# EAGLE design TERRA-v1 (EAGLE 9.6.2)
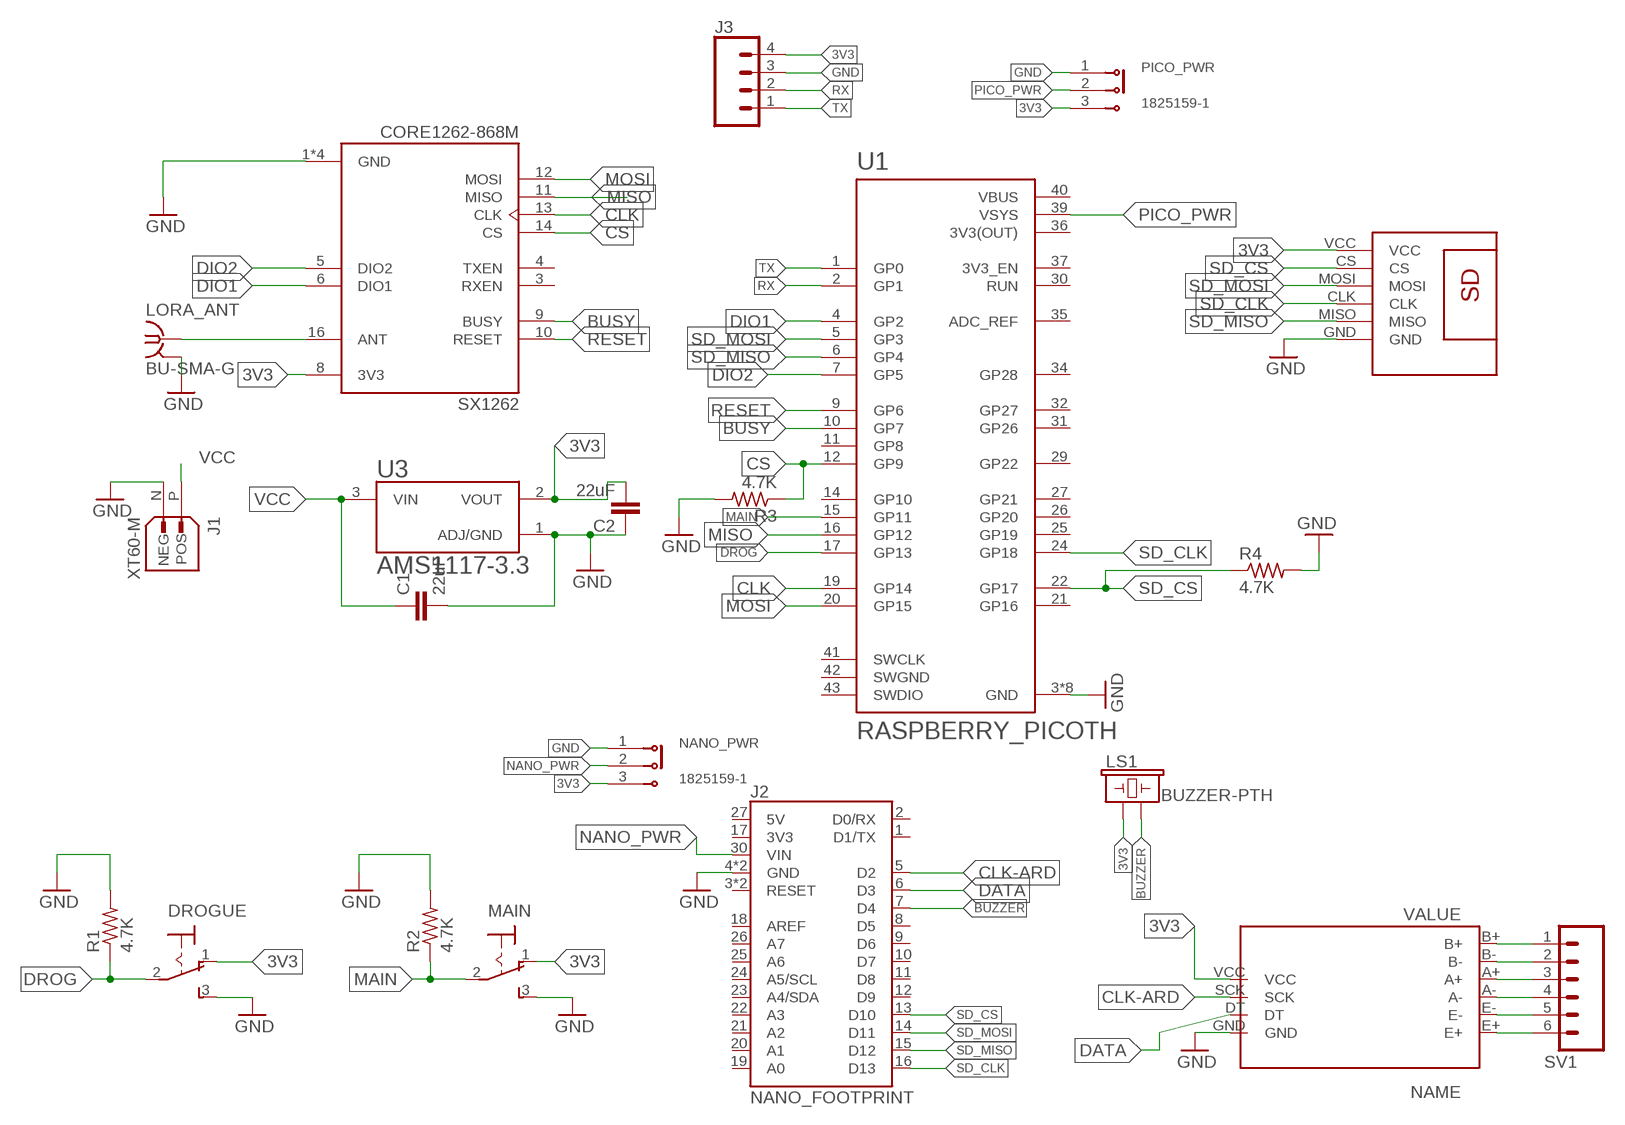
[diagram p0: schematic, sheet 1]

## Parts
C1  22uF  22UF-0805-6.3V-20%  [0805]
C2  22uF  22UF-0805-6.3V-20%  [0805]
DROGUE  M9040P  [M9040P]
HX711  HX711  HX711A  [HX711]
J1  XT60-M  [AMASS_XT60-M]
J2  NANO_FOOTPRINT  [NANO]
J3  CONN_04PTH  [1X04]
LORA_ANT  BU-SMA-G  [BU-SMA-G]
LS1  BUZZER-PTH  [BUZZER-12MM]
MAIN  M9040P  [M9040P]
NANO_PWR  1825159-1  [SW_1825159-1]
PICO_PWR  1825159-1  [SW_1825159-1]
R1  4.7K  R-US_R0805  [R0805]
R2  4.7K  R-US_R0805  [R0805]
R3  4.7K  R-US_R0805  [R0805]
R4  4.7K  R-US_R0805  [R0805]
SV1  CONN_06SILK_FEMALE_PTH  [1X06]
SX1262  CORE1262-868M  [XCVR_CORE1262-868M]
U1  RASPBERRY_PICOTH  [PICO-PKG-TH]
U3  AMS1117-3.3  [SOT229P700X180-4N]
U$1  SDREADER  [SDREADER]

## Nets
3V3: C2.2 DROGUE.1(O) HX711.VCC J3.4 LS1.+ MAIN.1(O) NANO_PWR.3 PICO_PWR.3 SX1262.8(3V3) U3.2(VOUT) U$1.VCC
BUSY: SX1262.9(BUSY) U1.10(GP7)
BUZZER: J2.7(D4) LS1.-
CLK: SX1262.13(CLK) U1.19(GP14)
CLK-ARD: HX711.SCK J2.5(D2)
CS: R3.1 SX1262.14(CS) U1.12(GP9)
DATA: HX711.DT J2.6(D3)
DIO1: SX1262.6(DIO1) U1.4(GP2)
DIO2: SX1262.5(DIO2) U1.7(GP5)
DROG: DROGUE.2(P) R1.1 U1.17(GP13)
GND: C1.2 C2.1 DROGUE.3(S) HX711.GND J1.N(NEG) J2.4(GND) J2.29(GND) J3.3 LORA_ANT.2 LORA_ANT.3 LORA_ANT.4 LORA_ANT.5 MAIN.3(S) NANO_PWR.1 PICO_PWR.1 R1.2 R2.2 R3.2 R4.2 SX1262.1(GND) SX1262.2(GND) SX1262.7(GND) SX1262.15(GND) U1.3(GND) U1.8(GND) U1.13(GND) U1.18(GND) U1.23(GND) U1.28(GND) U1.33(GND) U1.38(GND) U3.1(ADJ/GND) U$1.GND
MAIN: MAIN.2(P) R2.1 U1.15(GP11)
MISO: SX1262.11(MISO) U1.16(GP12)
MOSI: SX1262.12(MOSI) U1.20(GP15)
N$1: LORA_ANT.1 SX1262.16(ANT)
N$2: HX711.B+ SV1.1
N$3: HX711.B- SV1.2
N$4: HX711.A+ SV1.3
N$5: HX711.A- SV1.4
N$6: HX711.E- SV1.5
N$7: HX711.E+ SV1.6
NANO_PWR: J2.30(VIN) NANO_PWR.2
PICO_PWR: PICO_PWR.2 U1.39(VSYS)
RESET: SX1262.10(RESET) U1.9(GP6)
RX: J3.2 U1.2(GP1)
SD_CLK: J2.16(D13) U1.24(GP18) U$1.CLK
SD_CS: J2.13(D10) R4.1 U1.22(GP17) U$1.CS
SD_MISO: J2.15(D12) U1.6(GP4) U$1.MISO
SD_MOSI: J2.14(D11) U1.5(GP3) U$1.MOSI
TX: J3.1 U1.1(GP0)
VCC: C1.1 J1.P(POS) U3.3(VIN)
Unconnected: J2.1(D1/TX) J2.2(D0/RX) J2.3(RESET) J2.8(D5) J2.9(D6) J2.10(D7) J2.11(D8) J2.12(D9) J2.17(3V3) J2.18(AREF) J2.19(A0) J2.20(A1) J2.21(A2) J2.22(A3) J2.23(A4/SDA) J2.24(A5/SCL) J2.25(A6) J2.26(A7) J2.27(5V) J2.28(RESET) SX1262.3(RXEN) SX1262.4(TXEN) U1.11(GP8) U1.14(GP10) U1.21(GP16) U1.25(GP19) U1.26(GP20) U1.27(GP21) U1.29(GP22) U1.30(RUN) U1.31(GP26) U1.32(GP27) U1.34(GP28) U1.35(ADC_REF) U1.37(3V3_EN) U1.41(SWCLK) U1.43(SWDIO)

## Power pins joined to a net without a drawn wire
3V3(OUT): U1.36(3V3(OUT))
SWGND: U1.42(SWGND)
VBUS: U1.40(VBUS)

## Library data of the parts
C1 C2 = SparkFun-Capacitors:22UF: 22µF ceramic capacitors A capacitor is a passive two-terminal electrical component used to store electrical energy temporarily in an electric field.; PROD_ID: CAP-08402
DROGUE MAIN = switch:M9040P: TOGGLE SWITCH Marquardt
HX711 = HX711:HX711
J1 = XT60-M:XT60-M: Check availability <https://pricing.snapeda.com/parts/XT60-M/AMASS/view-part?ref=eda>; AVAILABILITY: Not in stock; DESCRIPTION: Plug; DC supply; XT60; male; PIN: 2; for cable; soldered; 30A; 500V; MF: AMASS; MP: XT60-M; PACKAGE: Package; PRICE: None
J2 = SparkFun-Boards:NANO_FOOTPRINT: Generic Nano Footprint
J3 = SparkFun-Connectors:CONN_04: Multi connection point. Often used as Generic Header-pin footprint for 0.1 inch spaced/style header connections On any of the 0.1 inch spaced packages, you can populate with these: Break Away Headers - Straight <https://www.sparkfun.com/products/116> (PRT-00116) Break Away Male Headers - Right Angle <https://www.sparkfun.com/products/553> (PRT-00553) Female Headers <https://www.sparkfun.com/products/115> (PRT-00115) Break Away Headers - Machine Pin <https://www.sparkfun.com/products/117> (PRT-00117) Break Away Female Headers - Swiss Machine Pin <https://www.sparkfun.com/products/743> (PRT-00743) For SCREWTERMINALS and SPRING TERMINALS visit here: Screw Terimnals on SparkFun.com <https://www.sparkfun.com/search/results?term=Screw+Terminals> (5mm/3.5mm/2.54mm spacing) This device is also useful as a general connection point to wire up your design to another part of your project. Our various solder wires solder well into these plated through hole pads. Hook-Up Wire - Assortment (Stranded, 22 AWG) <https://www.sparkfun.com/products/11375> (PRT-11375) Hook-Up Wire - Assortment (Solid Core, 22 AWG) <https://www.sparkfun.com/products/11367> (PRT-11367) View the entire wire category on our website here <https://www.sparkfun.com/categories/141> Special notes: Molex polarized connector foot print use with SKU : PRT-08231 with associated crimp pins and housings. 1MM SMD Version SKU: PRT-10208; PROD_ID: CONN-09696
LORA_ANT = con-coax:BU-SMA-G: FEMALE SMA CONNECTOR Radiall distributor RS 193-9117; OC_FARNELL: unknown; OC_NEWARK: unknown
LS1 = SparkFun-Electromechanical:BUZZER: Buzzer Small round buzzers that operate around the audible 2kHz range. You can use these as speakers to create simple music or user interfaces. Variant Overview: PTH - Mini Speaker - PC Mount 12mm 2.048kHz <https://www.sparkfun.com/products/7950> PTH_KIT - Mini Speaker - PC Mount 12mm 2.048kHz <https://www.sparkfun.com/products/7950> KIT simplifies soldering by adding stop mask to one side of the pads. PTH_NO_SILK - Mini Speaker - PC Mount 12mm 2.048kHz <https://www.sparkfun.com/products/7950> No silkscreen indicator of buzzer outline. PTH_KIT_NO_SILK - Mini Speaker - PC Mount 12mm 2.048kHz <https://www.sparkfun.com/products/7950> KIT package w/o silkscreen SMD - Buzzer Audio Magnetic (CCV-084B16) SMD buzzer used on, e.g. the LilyPad Buzzer <https://www.sparkfun.com/products/8463> and RFID USB Reader <https://www.sparkfun.com/products/9963>. SMD_KIT - Buzzer Audio Magnetic (CCV-084B16) SMD Buzzer with elongated pins to make soldering easier. Used on the SparkFun Simon Says - Surface Mount Soldering Kit <https://www.sparkfun.com/products/10935>. SMD-SQUARE - Buzzer Audio Magnetic (COMP-15701) SMT square buzzer with one chamfered corner.; PROD_ID: COMP-08253; SF_SKU: COM-07950
NANO_PWR PICO_PWR = 1825159-1:1825159-1: SWITCH SLIDE SPDT 300MA 125V Check availability <https://pricing.snapeda.com/parts/1825159-1/TE%20Connectivity/view-part?ref=eda>; AVAILABILITY: In Stock; COMMENT: 1825159-1; CONFIGURATION_POLE-THROW: Single Pole - Double Throw; CONTACT_CURRENT_RATING: .25 A; DESCRIPTION: Slide Switch SPDT Through Hole; EU_ROHS_COMPLIANCE: Compliant; MF: TE Connectivity; MP: 1825159-1; PACKAGE: None; PRICE: None; PURCHASE-URL: https://pricing.snapeda.com/search/part/1825159-1/?ref=eda; SWITCH_TYPE: Slide
R1-R4 = rcl:R-US_: RESISTOR, American symbol; SPICEPREFIX: R
SV1 = SparkFun-Connectors:CONN_06: Multi connection point. Often used as Generic Header-pin footprint for 0.1 inch spaced/style header connections On any of the 0.1 inch spaced packages, you can populate with these: Break Away Headers - Straight <https://www.sparkfun.com/products/116> (PRT-00116) Break Away Male Headers - Right Angle <https://www.sparkfun.com/products/553> (PRT-00553) Female Headers <https://www.sparkfun.com/products/115> (PRT-00115) Break Away Headers - Machine Pin <https://www.sparkfun.com/products/117> (PRT-00117) Break Away Female Headers - Swiss Machine Pin <https://www.sparkfun.com/products/743> (PRT-00743) Arduino Stackable Header - 6 Pin <https://www.sparkfun.com/products/9280> (PRT-09280) For SCREWTERMINALS and SPRING TERMINALS visit here: Screw Terimnals on SparkFun.com <https://www.sparkfun.com/search/results?term=Screw+Terminals> (5mm/3.5mm/2.54mm spacing) This device is also useful as a general connection point to wire up your design to another part of your project. Our various solder wires solder well into these plated through hole pads. Hook-Up Wire - Assortment (Stranded, 22 AWG) <https://www.sparkfun.com/products/11375> (PRT-11375) Hook-Up Wire - Assortment (Solid Core, 22 AWG) <https://www.sparkfun.com/products/11367> (PRT-11367) View the entire wire category on our website here <https://www.sparkfun.com/categories/141>; PROD_ID: CONN-08437
SX1262 = CORE1262-868M:CORE1262-868M: Check availability <https://pricing.snapeda.com/parts/Core1262-868M/Waveshare%20Electronics/view-part?ref=eda>; AVAILABILITY: Not in stock; DESCRIPTION: Lora core module; MF: Waveshare Electronics; MP: Core1262-868M; PACKAGE: Package; PRICE: None
U1 = RpiPico:RASPBERRY_PICO: Raspberry Pi Pico
U3 = AMS1117-3.3:AMS1117-3.3: Sot223/Pkg 1-Amp 3.3-Volt Low Drop Out Voltage Regulatator Check availability <https://pricing.snapeda.com/parts/AMS1117-3.3/Advanced%20Monolithic%20Systems/view-part?ref=eda>; AVAILABILITY: Not in stock; DESCRIPTION: Sot223/Pkg 1-Amp 3.3-Volt Low Drop Out Voltage Regulatator; MF: Advanced Monolithic Systems; MP: AMS1117-3.3; PACKAGE: SOT-223 Seeed Technology; PRICE: None
U$1 = SDREADER:SDREADER

## Board
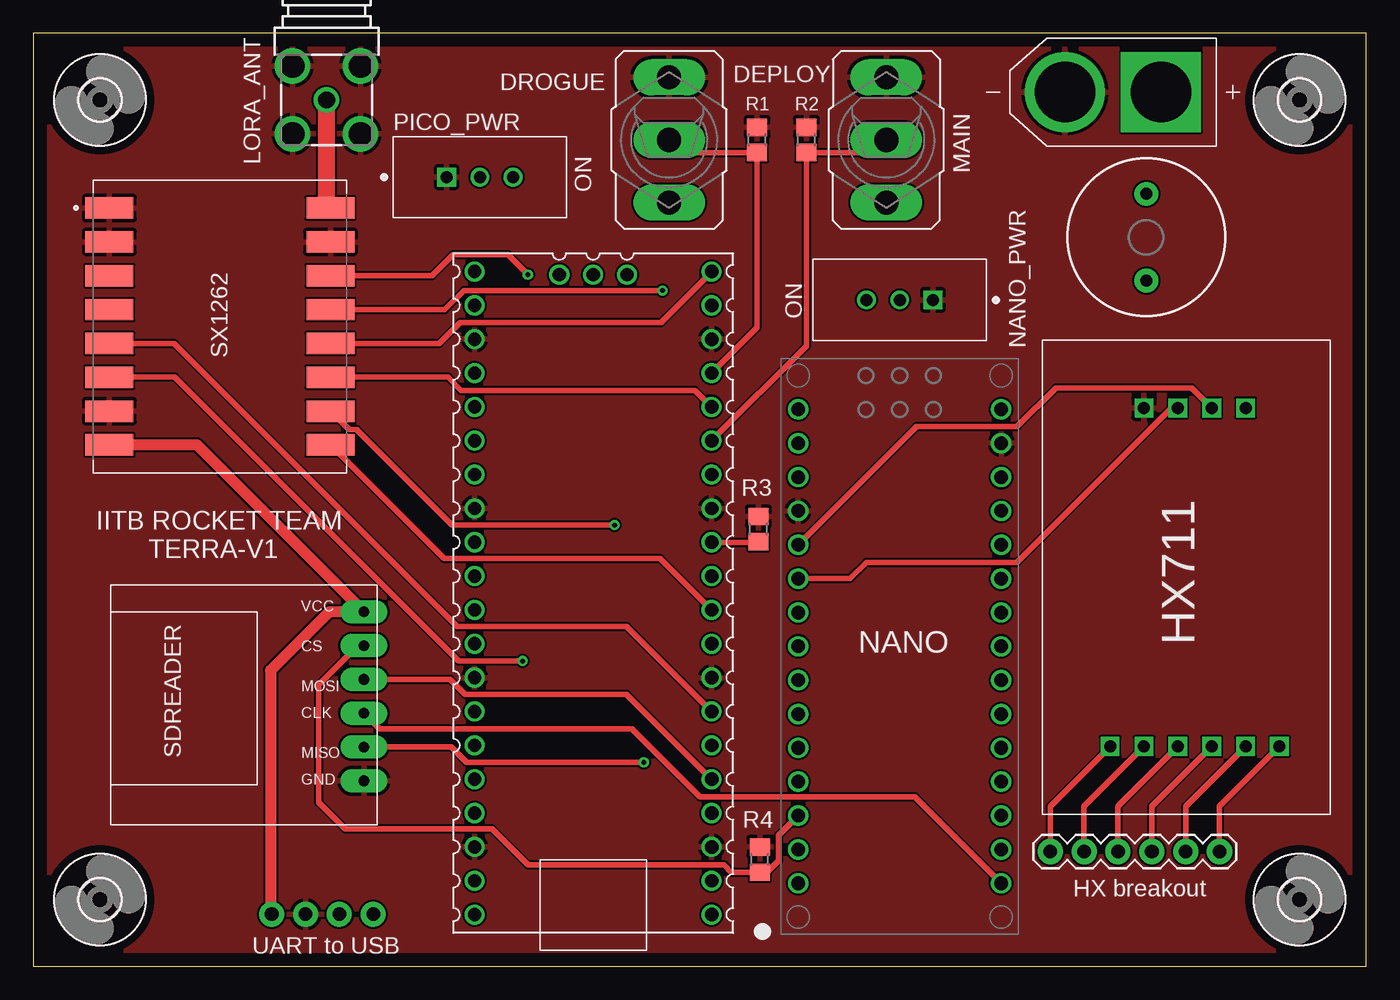
[diagram p1: board, top side]
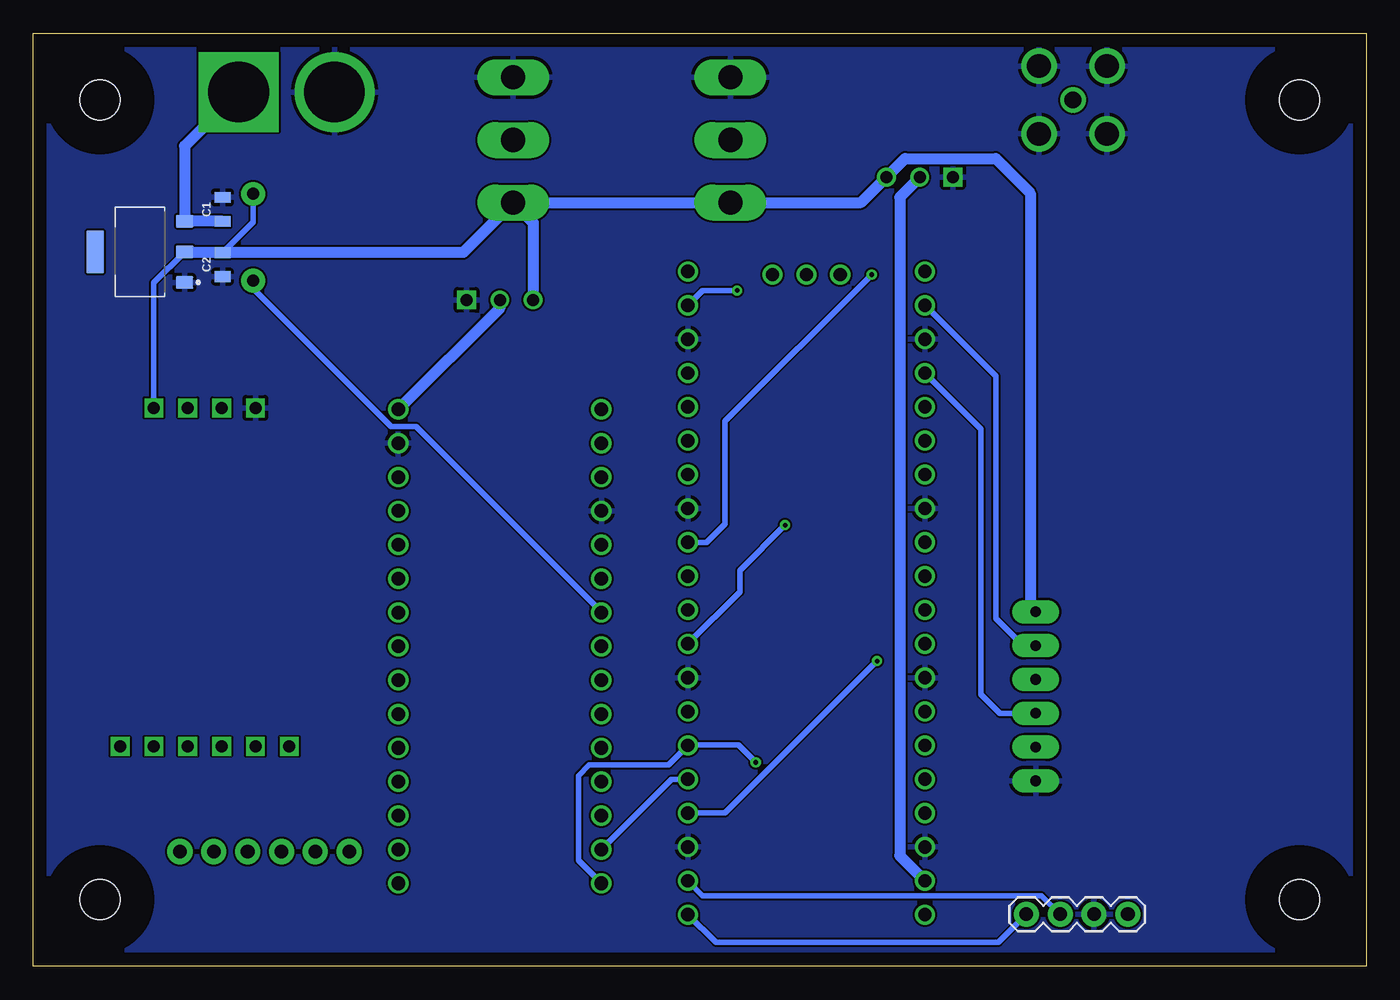
[diagram p2: board, bottom side, seen from below]

Size 100 x 70 mm. Coordinates in mm from the lower left corner, seen from the top.
Outline: 0,0 100,0 100,70 0,70 0,0
Copper layers (1*16): Top 0.035mm / dielectric 1.5mm / Bottom 0.035mm
Design rules "default": minimum track width 6mil, minimum drill 0.35mm, track to track 6mil, track to pad 6mil, pad to pad 6mil, via to via 6mil, smd to smd 6mil, copper to edge 40mil, drill to drill 6mil, minimum pad ring 10mil, minimum via ring 8mil, stop-mask expansion 4mil, vias tented up to drill 0mil, thermal gap 10mil

### Footprints (pad centres in the part's own frame; a part is rotated, then mirrored left to right if it is on the bottom)
0805 = smd 0.8 x 1.2: 1 -0.9,0; 2 0.9,0
M9040P = drill 1.803 long: 1 0,4.699; 2 0,0; 3 0,-4.699
HX711 = drill 0.9 square: A+ 8.89,21.59; A- 8.89,24.13; B+ 8.89,16.51; B- 8.89,19.05; DT 34.29,24.13; E+ 8.89,29.21; E- 8.89,26.67; GND 34.29,26.67; SCK 34.29,21.59; VCC 34.29,19.05
AMASS_XT60-M = drill 4.55 pad 6: N 3.6,0 | drill 4.55 pad 6 square: P -3.6,0
NANO = drill 1.016: 1 -7.62,17.78; 2 -7.62,15.24; 3 -7.62,12.7; 4 -7.62,10.16; 5 -7.62,7.62; 6 -7.62,5.08; 7 -7.62,2.54; 8 -7.62,0; 9 -7.62,-2.54; 10 -7.62,-5.08; 11 -7.62,-7.62; 12 -7.62,-10.16; 13 -7.62,-12.7; 14 -7.62,-15.24; 15 -7.62,-17.78; 16 7.62,-17.78; 17 7.62,-15.24; 18 7.62,-12.7; 19 7.62,-10.16; 20 7.62,-7.62; 21 7.62,-5.08; 22 7.62,-2.54; 23 7.62,0; 24 7.62,2.54; 25 7.62,5.08; 26 7.62,7.62; 27 7.62,10.16; 28 7.62,12.7; 29 7.62,15.24; 30 7.62,17.78
1X04 = drill 1.016 pad 1.88: 1 0,0; 2 2.54,0; 3 5.08,0; 4 7.62,0
BU-SMA-G = drill 1.27: 1 0,0 | drill 1.778: 2 -2.55,2.55; 3 2.55,2.55; 4 2.55,-2.55; 5 -2.55,-2.55
BUZZER-12MM = drill 0.9 pad 1.778: + 3.25,0; - -3.25,0
SW_1825159-1 = drill 0.9 square: 1 -2.5,0 | drill 0.9: 2 0,0; 3 2.5,0
R0805 = smd 1.3 x 1.5: 1 -0.95,0; 2 0.95,0
1X06 = drill 1.016 pad 1.88: 1 0,0; 2 2.54,0; 3 5.08,0; 4 7.62,0; 5 10.16,0; 6 12.7,0
XCVR_CORE1262-868M = smd 3.61 x 1.61: 1 -8.3,8.89; 2 -8.3,6.35; 3 -8.3,3.81; 4 -8.3,1.27; 5 -8.3,-1.27; 6 -8.3,-3.81; 7 -8.3,-6.35; 8 -8.3,-8.89; 9 8.3,-8.89; 10 8.3,-6.35; 11 8.3,-3.81; 12 8.3,-1.27; 13 8.3,1.27; 14 8.3,3.81; 15 8.3,6.35; 16 8.3,8.89
PICO-PKG-TH = drill 1: 1 -8.89,24.13; 2 -8.89,21.59; 3 -8.89,19.05; 4 -8.89,16.51; 5 -8.89,13.97; 6 -8.89,11.43; 7 -8.89,8.89; 8 -8.89,6.35; 9 -8.89,3.81; 10 -8.89,1.27; 11 -8.89,-1.27; 12 -8.89,-3.81; 13 -8.89,-6.35; 14 -8.89,-8.89; 15 -8.89,-11.43; 16 -8.89,-13.97; 17 -8.89,-16.51; 18 -8.89,-19.05; 19 -8.89,-21.59; 20 -8.89,-24.13; 21 8.89,-24.13; 22 8.89,-21.59; 23 8.89,-19.05; 24 8.89,-16.51; 25 8.89,-13.97; 26 8.89,-11.43; 27 8.89,-8.89; 28 8.89,-6.35; 29 8.89,-3.81; 30 8.89,-1.27; 31 8.89,1.27; 32 8.89,3.81; 33 8.89,6.35; 34 8.89,8.89; 35 8.89,11.43; 36 8.89,13.97; 37 8.89,16.51; 38 8.89,19.05; 39 8.89,21.59; 40 8.89,24.13; 41 -2.54,-23.9; 42 0,-23.9; 43 2.54,-23.9
SOT229P700X180-4N = smd 0.93 x 1.31: 1 -2.29,-3.345; 2 0,-3.345; 3 2.29,-3.345 | smd 3.24 x 1.31: 4 0,3.345
SDREADER = drill 0.8 pad 1.778 long: CLK 1,9.62; CS 1,4.54; GND 1,14.7; MISO 1,12.16; MOSI 1,7.08; VCC 1,2
3,0 = hole 3: 0,0

### Placement (x,y rotation side)
C1  85.8,56.79 90 bottom
C2  85.8,52.65 90 bottom
DROGUE  47.7,62 180 top
HX711  110,7.6 90 top
J1  81,65.6 180 top
J2  65,24 0 top
J3  25.5,3.9 0 bottom
LORA_ANT  22,65 90 top
LS1  83.5,54.7 90 top
MAIN  64,62 180 top
NANO_PWR  65,50 180 top
PICO_PWR  33.5,59.2 0 top
R1  54.3,62 90 top
R2  58,62 90 top
R3  54.4,32.8 90 top
R4  54.5,8 90 top
SV1  89,8.6 180 top
SX1262  14,48 0 top
U1  42,28 180 top
U3  92,53.6 90 bottom
U$1  25.8,28.6 180 top
U$2  [3,0]  95,65 0 top
U$3  [3,0]  5,5 0 top
U$5  [3,0]  95,5 0 top
U$6  [3,0]  5,65 0 top

### Tracks (layer width: path | path; a pad name or v marks a point on that pad's centre or on a via)
3V3
  Top 0.813: SX1262.8 12.29,39.11 U$1.VCC 22.2,26.6 17.8,22.2 17.8,3.98 J3.4
  Bottom 0.406: HX711.VCC 90.95,51.3 U3.2 | LS1.+ 83.5,55.85 C2.2
  Bottom 0.813: MAIN.1 DROGUE.1 37.9,57.3 PICO_PWR.3 34.6,60.6 27.8,60.6 25.2,58 25.2,27 U$1.VCC | MAIN.1 62.5,55.8 NANO_PWR.3 | MAIN.1 67.75,53.55 C2.2 88.61,53.55 U3.2
BUSY
  Top 0.406: SX1262.9 30.81,30.6 47.02,30.6 U1.10
BUZZER
  Bottom 0.406: LS1.- 83.5,50.85 73.15,40.5 71.3,40.5 57.34,26.54 J2.7
CLK  (via drill 0.35)
  Top 0.406: SX1262.13 30.87,49.27 32.3,50.7 v47.2,50.7
  Bottom 0.406: v47.2,50.7 49.78,50.7 U1.19
CLK-ARD
  Top 0.406: HX711.SCK 86.9,43.4 76.7,43.4 73.8,40.5 66.26,40.5 J2.5
CS  (via drill 0.35)
  Top 0.406: U1.12 54.36,31.81 R3.1 | SX1262.14 29.91,51.81 31.5,53.4 35.6,53.4 v37.1,51.9
  Bottom 0.406: v37.1,51.9 48.1,40.9 48.1,33.2 49.49,31.81 U1.12
DATA
  Top 0.406: HX711.DT 85.39,41.89 73.8,30.3 62.5,30.3 61.28,29.08 J2.6
DIO1  (via drill 0.35)
  Top 0.406: SX1262.6 10.61,44.19 31.9,22.9 v36.7,22.9
  Bottom 0.406: v36.7,22.9 48.11,11.49 U1.4
DIO2
  Top 0.406: SX1262.5 10.57,46.73 31.8,25.5 44.5,25.5 U1.7
DROG
  Top 0.406: DROGUE.2 48.65,61.05 R1.1 54.3,47.92 U1.17
GND
  pour Top: -0.2,70.2 -0.2,-0.2 100.3,-0.2 100.3,70.2
  pour Bottom: -0.4,70.2 -0.4,-0.2 100.3,-0.2 100.3,70.2
MAIN
  Top 0.406: MAIN.2 63.05,61.05 R2.1 58,46.54 U1.15
MISO
  Top 0.406: SX1262.11 31.11,44.19 32.1,43.2 49.66,43.2 U1.16
MOSI
  Top 0.406: SX1262.12 30.43,46.73 32,48.3 47.1,48.3 50.89,52.09 U1.20
N$1
  Top 1.016: SX1262.16 22,57.19
  Top 1.27: 22,57.19 LORA_ANT.1
N$2
  Top 0.406: HX711.B+ 88.99,11.99 SV1.1
N$3
  Top 0.406: HX711.B- 86.45,11.99 SV1.2
N$4
  Top 0.406: HX711.A+ 83.91,11.99 SV1.3
N$5
  Top 0.406: HX711.A- 81.37,11.99 SV1.4
N$6
  Top 0.406: HX711.E- 78.83,11.99 SV1.5
N$7
  Top 0.406: HX711.E+ 76.29,11.99 SV1.6
NANO_PWR
  Bottom 0.813: NANO_PWR.2 65,49.4 J2.30
PICO_PWR
  Bottom 0.813: PICO_PWR.2 35,57.7 35,8.3 U1.39
RESET  (via drill 0.35)
  Top 0.406: SX1262.10 23.68,40.27 24.25,40.27 31.42,33.1 v43.6,33.1
  Bottom 0.406: v43.6,33.1 47,29.7 47,28.1 50.89,24.21 U1.9
RX
  Bottom 0.406: J3.2 24.36,5.3 49.78,5.3 U1.2
SD_CLK
  Top 0.406: U$1.CLK 25.98,17.8 44.9,17.8 50,12.7 66.14,12.7 J2.16
  Bottom 0.406: U1.24 28.9,40.3 28.9,20.4 27.48,18.98 U$1.CLK
SD_CS
  Top 0.406: J2.13 55.9,9.82 55.9,7.9 55.05,7.05 R4.1 52.35,7.05 51.8,7.6 37.1,7.6 34.4,10.3 23.4,10.3 21.4,12.3 21.4,21.1 24.36,24.06 U$1.CS
  Bottom 0.406: U1.22 27.8,44.28 27.8,26.1 25.76,24.06 U$1.CS
SD_MISO  (via drill 0.35)
  Top 0.406: U$1.MISO 31.36,16.44 32.5,15.3 v45.8,15.3
  Bottom 0.406: v45.8,15.3 47.1,16.6 50.86,16.6 U1.6 52.36,15.1 58.3,15.1 59.1,14.3 59.1,7.94 J2.15
SD_MOSI
  Top 0.406: U$1.MOSI 31.28,21.52 32.4,20.4 44.52,20.4 U1.5
  Bottom 0.406: U1.5 52.11,14.03 J2.14
TX
  Bottom 0.406: J3.1 27.6,1.8 48.8,1.8 50.87,3.87 U1.1
VCC
  Bottom 0.813: J1.P 88.66,61.55 U3.3 88.64,55.9 88.64,55.89 C1.1

### Text on the board
tPlace: DEPLOY | ON | ON | IITB ROCKET TEAM / TERRA-V1 | NANO | HX breakout | UART to USB